# Altium schematic sheet Universal Fan Fixture.SchDoc
size A; DocumentNumber: 1; SheetNumber: 1; SheetTotal: 4; PageSetup: Record=PageOptions|CenterHorizontal=True|CenterVertical=True|PrintScale=1.12|XCorrection=1.00|YCorrection=1.00|PrintKind=1|BorderSize=5000000|LeftOffset=0|BottomOffset=0|Orientation=2|PaperLength=2794|PaperWidth=2159|Scale=100|PaperSource=15|PrintQuality=600|MediaType=1|DitherType=10|PaperKind=Letter|PrintScaleMode=1
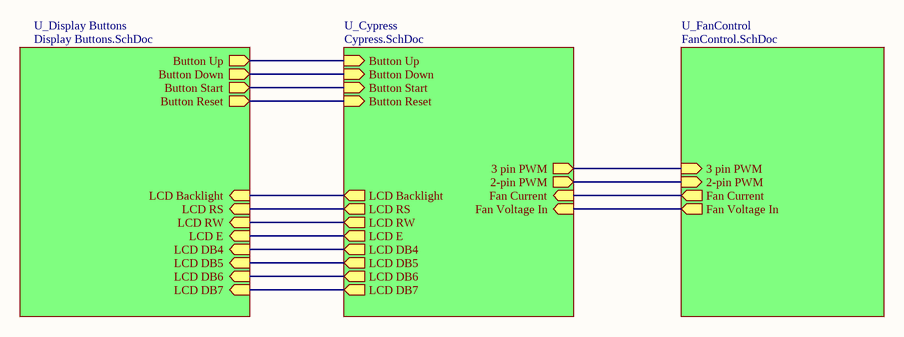
[diagram p0: Universal Fan Fixture.SchDoc]

## Sub-sheets
U_Cypress = Cypress.SchDoc: LCD DB4 (out), LCD DB5 (out), LCD DB7 (out), LCD DB6 (out), LCD E (out), LCD RS (out), LCD RW (out), LCD Backlight (out), Button Down (in), Button Start (in), Button Up (in), Button Reset (in), 3 pin PWM (out), 2-pin PWM (out), Fan Current (in), Fan Voltage In (in)
U_Display Buttons = Display Buttons.SchDoc: Button Down (out), Button Start (out), Button Up (out), Button Reset (out), LCD Backlight (in), LCD RS (in), LCD RW (in), LCD E (in), LCD DB4 (in), LCD DB5 (in), LCD DB6 (in), LCD DB7 (in)
U_FanControl = FanControl.SchDoc: Fan Voltage In (out), Fan Current (out), 3 pin PWM (in), 2-pin PWM (in)

## Nets
(unnamed): sheet U_Cypress/LCD DB4, sheet U_Display Buttons/LCD DB4
(unnamed): sheet U_Cypress/LCD DB5, sheet U_Display Buttons/LCD DB5
(unnamed): sheet U_Cypress/LCD DB7, sheet U_Display Buttons/LCD DB7
(unnamed): sheet U_Cypress/LCD DB6, sheet U_Display Buttons/LCD DB6
(unnamed): sheet U_Cypress/LCD E, sheet U_Display Buttons/LCD E
(unnamed): sheet U_Cypress/LCD RS, sheet U_Display Buttons/LCD RS
(unnamed): sheet U_Cypress/LCD RW, sheet U_Display Buttons/LCD RW
(unnamed): sheet U_Cypress/LCD Backlight, sheet U_Display Buttons/LCD Backlight
(unnamed): sheet U_Cypress/Button Down, sheet U_Display Buttons/Button Down
(unnamed): sheet U_Cypress/Button Start, sheet U_Display Buttons/Button Start
(unnamed): sheet U_Cypress/Button Up, sheet U_Display Buttons/Button Up
(unnamed): sheet U_Cypress/Button Reset, sheet U_Display Buttons/Button Reset
(unnamed): sheet U_Cypress/3 pin PWM, sheet U_FanControl/3 pin PWM
(unnamed): sheet U_Cypress/2-pin PWM, sheet U_FanControl/2-pin PWM
(unnamed): sheet U_Cypress/Fan Current, sheet U_FanControl/Fan Current
(unnamed): sheet U_Cypress/Fan Voltage In, sheet U_FanControl/Fan Voltage In